# EAGLE schematic MainECU rev10 (EAGLE 9.6.2)

## Sheet 1 of 4: Inputs/Outputs and Power
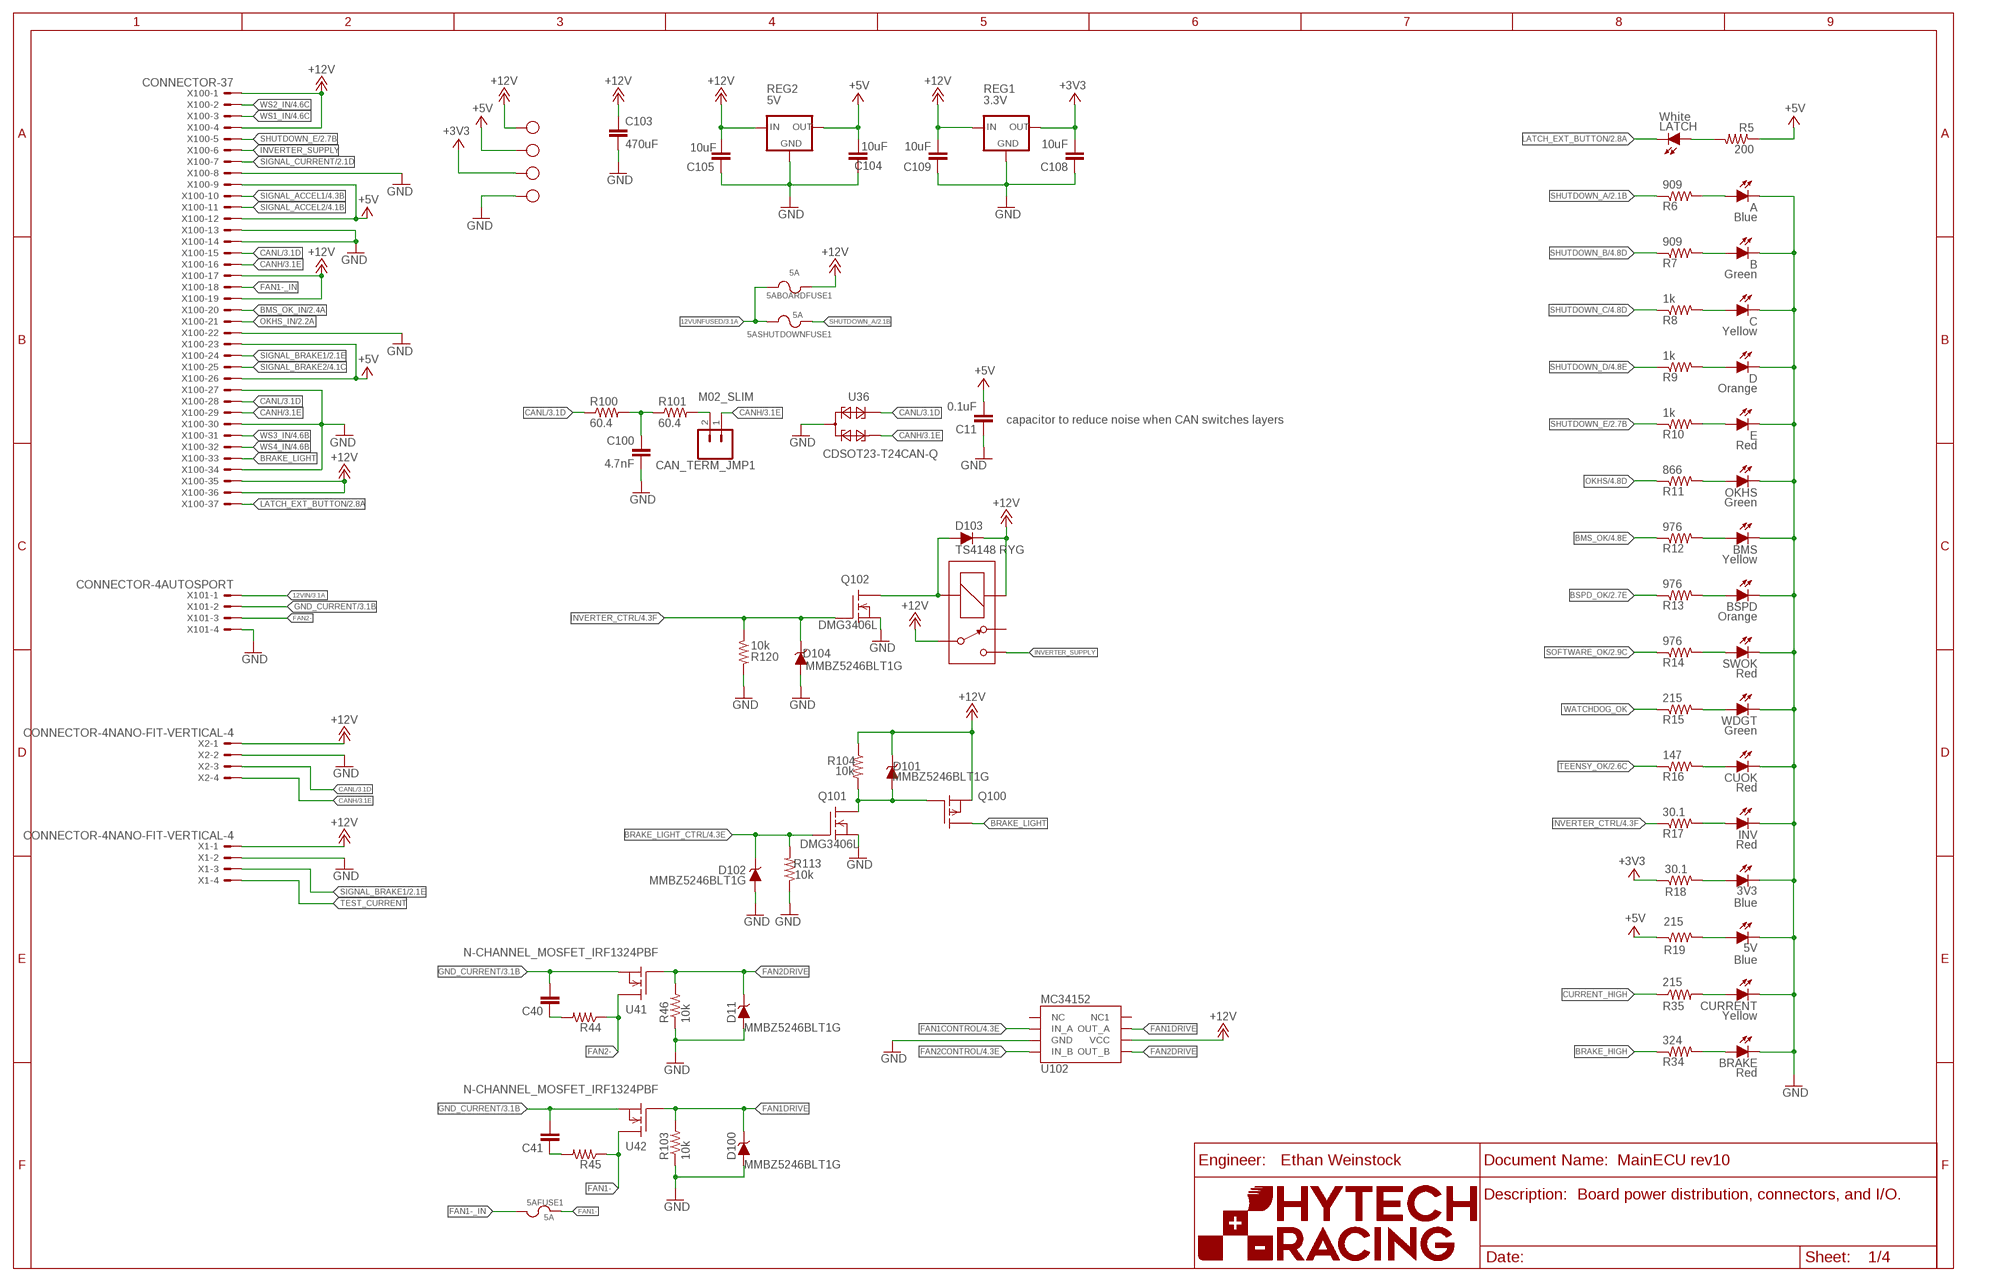
[diagram p0: schematic, sheet 1]
U201 (FRAME_B_L): ORIENTATION: LANDSCAPE; SIZE: B

### Parts
3V3  Blue  LED-0805  [LED-805]
3V3_TEST  TEST_POINTMICRO_MINIATURE  [MICRO_MINIATURE]
5ABOARDFUSE1  5A  FUSE_MINIBLADE  [MINI-BLADE_FUSE_HOLDER]
5AFUSE1  5A  FUSE_MINIBLADE  [MINI-BLADE_FUSE_HOLDER]
5ASHUTDOWNFUSE1  5A  FUSE_MINIBLADE  [MINI-BLADE_FUSE_HOLDER]
5V  Blue  LED-0805  [LED-805]
12V_TEST  12V_TEST  TEST_POINTMICRO_MINIATURE  [MICRO_MINIATURE]
A  Blue  LED-0805  [LED-805]
B  Green  LED-0805  [LED-805]
BMS  Yellow  LED-0805  [LED-805]
BRAKE  Red  LED-0805  [LED-805]
BSPD  Orange  LED-0805  [LED-805]
C  Yellow  LED-0805  [LED-805]
C11  0.1uF  CAP0603-CAP  [0603-CAP]
C40  CAP0603-CAP  [0603-CAP]
C41  CAP0603-CAP  [0603-CAP]
C100  4.7nF  CAP0603-CAP  [0603-CAP]
C103  470uF  CAPPTH3  [CAP-PTH-LARGE]
C104  10uF  CAP0603-CAP  [0603-CAP]
C105  10uF  CAP0603-CAP  [0603-CAP]
C108  10uF  CAP0603-CAP  [0603-CAP]
C109  10uF  CAP0603-CAP  [0603-CAP]
CAN_TERM_JMP1  M02_SLIM  [1X02_SLIM]
CUOK  Red  LED-0805  [LED-805]
CURRENT  Yellow  LED-0805  [LED-805]
D  Orange  LED-0805  [LED-805]
D11  MMBZ5246BLT1G  DIODE_ZENER  [SOT23]
D100  MMBZ5246BLT1G  DIODE_ZENER  [SOT23]
D101  MMBZ5246BLT1G  DIODE_ZENER  [SOT23]
D102  MMBZ5246BLT1G  DIODE_ZENER  [SOT23]
D103  TS4148 RYG  DIODE0805  [0805_D]
D104  MMBZ5246BLT1G  DIODE_ZENER  [SOT23]
E  Red  LED-0805  [LED-805]
INV  Red  LED-0805  [LED-805]
INVERTER_PWR_RELAY1  G5LE  [ZF112]
LATCH  White  LED-0805  [LED-805]
OKHS  Green  LED-0805  [LED-805]
Q100  P-CHANNEL_MOSFET_DMP3099L-7  [SOT23]
Q101  DMG3406L  DMG3406LSOT  [SOT23]
Q102  DMG3406L  DMG3406LSOT  [SOT23]
R5  200  RESISTOR0603  [0603-RES]
R6  909  RESISTOR0603  [0603-RES]
R7  909  RESISTOR0603  [0603-RES]
R8  1k  RESISTOR0603  [0603-RES]
R9  1k  RESISTOR0603  [0603-RES]
R10  1k  RESISTOR0603  [0603-RES]
R11  866  RESISTOR0603  [0603-RES]
R12  976  RESISTOR0603  [0603-RES]
R13  976  RESISTOR0603  [0603-RES]
R14  976  RESISTOR0603  [0603-RES]
R15  215  RESISTOR0603  [0603-RES]
R16  147  RESISTOR0603  [0603-RES]
R17  30.1  RESISTOR0603  [0603-RES]
R18  30.1  RESISTOR0603  [0603-RES]
R19  215  RESISTOR0603  [0603-RES]
R34  324  RESISTOR0603  [0603-RES]
R35  215  RESISTOR0603  [0603-RES]
R44  RESISTOR0603  [0603-RES]
R45  RESISTOR0603  [0603-RES]
R46  10k  RESISTOR0603  [0603-RES]
R100  60.4  RESISTOR0603  [0603-RES]
R101  60.4  RESISTOR0603  [0603-RES]
R103  10k  RESISTOR0603  [0603-RES]
R104  10k  RESISTOR0603  [0603-RES]
R113  10k  RESISTOR0603  [0603-RES]
R120  10k  RESISTOR0603  [0603-RES]
REG1  3.3V  OKI-78SR-3.3  [OKI-78SR]
REG2  5V  OKI-78SR-5  [OKI-78SR]
SWOK  Red  LED-0805  [LED-805]
U36  CDSOT23-T24CAN-Q  [SOT23]
U40  TEST_POINTMICRO_MINIATURE  [MICRO_MINIATURE]
U41  N-CHANNEL_MOSFET_IRF1324PBF  N-CHANNEL_MOSFET_HOR_HOLE  [TO-220-H-HOLE]
U42  N-CHANNEL_MOSFET_IRF1324PBF  N-CHANNEL_MOSFET_HOR_HOLE  [TO-220-H-HOLE]
U43  TEST_POINTMICRO_MINIATURE  [MICRO_MINIATURE]
U102  MC34152  [SOIC-08]
WDGT  Green  LED-0805  [LED-805]
X1  CONNECTOR-4NANO-FIT-VERTICAL-4  [NANO-FIT_VERTICAL-4]
X2  CONNECTOR-4NANO-FIT-VERTICAL-4  [NANO-FIT_VERTICAL-4]
X100  CONNECTOR-37  [AUTOSPORT_14-35]
X101  CONNECTOR-4AUTOSPORT  [AUTOSPORT_12-04]

### Nets
12VIN: X101.P$1 ; also sheet 3
12VUNFUSED: 5ABOARDFUSE1.L1 5ABOARDFUSE1.L2 5ASHUTDOWNFUSE1.L1 5ASHUTDOWNFUSE1.L2 ; also sheet 3
+3V3: 3V3_TEST.P$1 C108.2 R18.1 REG1.3(OUT) ; also sheet 2,3,4
+5V: C11.2 C104.2 R5.1 R19.1 REG2.3(OUT) U43.P$1 X100.P$9 X100.P$12 X100.P$23 X100.P$26 ; also sheet 2,3,4
+12V: 5ABOARDFUSE1.R1 5ABOARDFUSE1.R2 12V_TEST.P$1 C103.1 C105.2 C109.2 D101.3(C) D103.C INVERTER_PWR_RELAY1.1(COIL+) INVERTER_PWR_RELAY1.P Q100.2(S) R104.1 REG1.1(IN) REG2.1(IN) U102.6(VCC) X1.P$1 X2.P$1 X100.P$1 X100.P$4 X100.P$17 X100.P$19 X100.P$35 X100.P$36 ; also sheet 2,3
BMS_OK: R12.1 ; also sheet 2,4
BMS_OK_IN: X100.P$20 ; also sheet 2
BRAKE_HIGH: R34.1 ; also sheet 2
BRAKE_LIGHT: Q100.3(D) X100.P$33
BRAKE_LIGHT_CTRL: D102.3(C) Q101.1(G) R113.2 ; also sheet 4
BSPD_OK: R13.1 ; also sheet 2,4
CANH: CAN_TERM_JMP1.1 U36.2 X2.P$4 X100.P$16 X100.P$29 ; also sheet 3,4
CANL: R100.1 U36.1 X2.P$3 X100.P$15 X100.P$28 ; also sheet 3,4
CURRENT_HIGH: R35.1 ; also sheet 2
FAN1-: 5AFUSE1.R1 5AFUSE1.R2 R45.1 U42.2(D)
FAN1-_IN: 5AFUSE1.L1 5AFUSE1.L2 X100.P$18
FAN1CONTROL: U102.2(IN_A) ; also sheet 4
FAN1DRIVE: D100.3(C) R103.2 U42.1(G) U102.7(OUT_A)
FAN2-: R44.1 U41.2(D) X101.P$3
FAN2CONTROL: U102.4(IN_B) ; also sheet 4
FAN2DRIVE: D11.3(C) R46.2 U41.1(G) U102.5(OUT_B)
GND: 3V3.C 5V.C A.C B.C BMS.C BRAKE.C BSPD.C C11.1 C100.2 C103.2 C104.1 C105.1 C108.1 C109.1 C.C CUOK.C CURRENT.C D11.1(A) D100.1(A) D102.1(A) D104.1(A) D.C E.C INV.C OKHS.C Q101.2(S) Q102.2(S) R46.1 R103.1 R113.1 R120.2 REG1.2(GND) REG2.2(GND) SWOK.C U36.3 U40.P$1 U102.3(GND) WDGT.C X1.P$2 X2.P$2 X100.P$8 X100.P$13 X100.P$14 X100.P$22 X100.P$27 X100.P$30 X100.P$34 X101.P$4 ; also sheet 2,3,4
GND_CURRENT: C40.2 C41.2 U41.3(S) U42.3(S) X101.P$2 ; also sheet 3
INVERTER_CTRL: D104.3(C) Q102.1(G) R17.1 R120.1 ; also sheet 4
INVERTER_SUPPLY: INVERTER_PWR_RELAY1.S X100.P$6
LATCH_EXT_BUTTON: LATCH.C X100.P$37 ; also sheet 2
N$9: E.A R10.2
N$20: R14.2 SWOK.A
N$21: R15.2 WDGT.A
N$23: CUOK.A R16.2
N$34: A.A R6.2
N$36: 3V3.A R18.2
N$65: C40.1 R44.2
N$74: C41.1 R45.2
N$97: B.A R7.2
N$98: C.A R8.2
N$99: LATCH.A R5.2
N$100: OKHS.A R11.2
N$101: BMS.A R12.2
N$102: CURRENT.A R35.2
N$103: BRAKE.A R34.2
N$108: BSPD.A R13.2
N$113: 5V.A R19.2
N$114: D101.1(A) Q100.1(G) Q101.3(D) R104.2
N$115: D.A R9.2
N$116: INV.A R17.2
N$117: D103.A INVERTER_PWR_RELAY1.2(COIL-) Q102.3(D)
N$118: CAN_TERM_JMP1.2 R101.2
N$119: C100.1 R100.2 R101.1
OKHS: R11.1 ; also sheet 2,4
OKHS_IN: X100.P$21 ; also sheet 2
SHUTDOWN_A: 5ASHUTDOWNFUSE1.R1 5ASHUTDOWNFUSE1.R2 R6.1 ; also sheet 2
SHUTDOWN_B: R7.1 ; also sheet 2,4
SHUTDOWN_C: R8.1 ; also sheet 2,4
SHUTDOWN_D: R9.1 ; also sheet 2,4
SHUTDOWN_E: R10.1 X100.P$5 ; also sheet 2,4
SIGNAL_ACCEL1: X100.P$10 ; also sheet 4
SIGNAL_ACCEL2: X100.P$11 ; also sheet 4
SIGNAL_BRAKE1: X1.P$3 X100.P$24 ; also sheet 2,4
SIGNAL_BRAKE2: X100.P$25 ; also sheet 4
SIGNAL_CURRENT: X100.P$7 ; also sheet 2
SOFTWARE_OK: R14.1 ; also sheet 2,4
TEENSY_OK: R16.1 ; also sheet 2,4
TEST_CURRENT: X1.P$4 ; also sheet 2
WATCHDOG_OK: R15.1 ; also sheet 2
WS1_IN: X100.P$3 ; also sheet 4
WS2_IN: X100.P$2 ; also sheet 4
WS3_IN: X100.P$31 ; also sheet 4
WS4_IN: X100.P$32 ; also sheet 4
Unconnected: INVERTER_PWR_RELAY1.O U102.1(NC) U102.8(NC1)

### Notes on the sheet
- capacitor to reduce noise when CAN switches layers
- Ethan Weinstock
- Board power distribution, connectors, and I/O.

## Sheet 2 of 4: Shutdown Circuitry
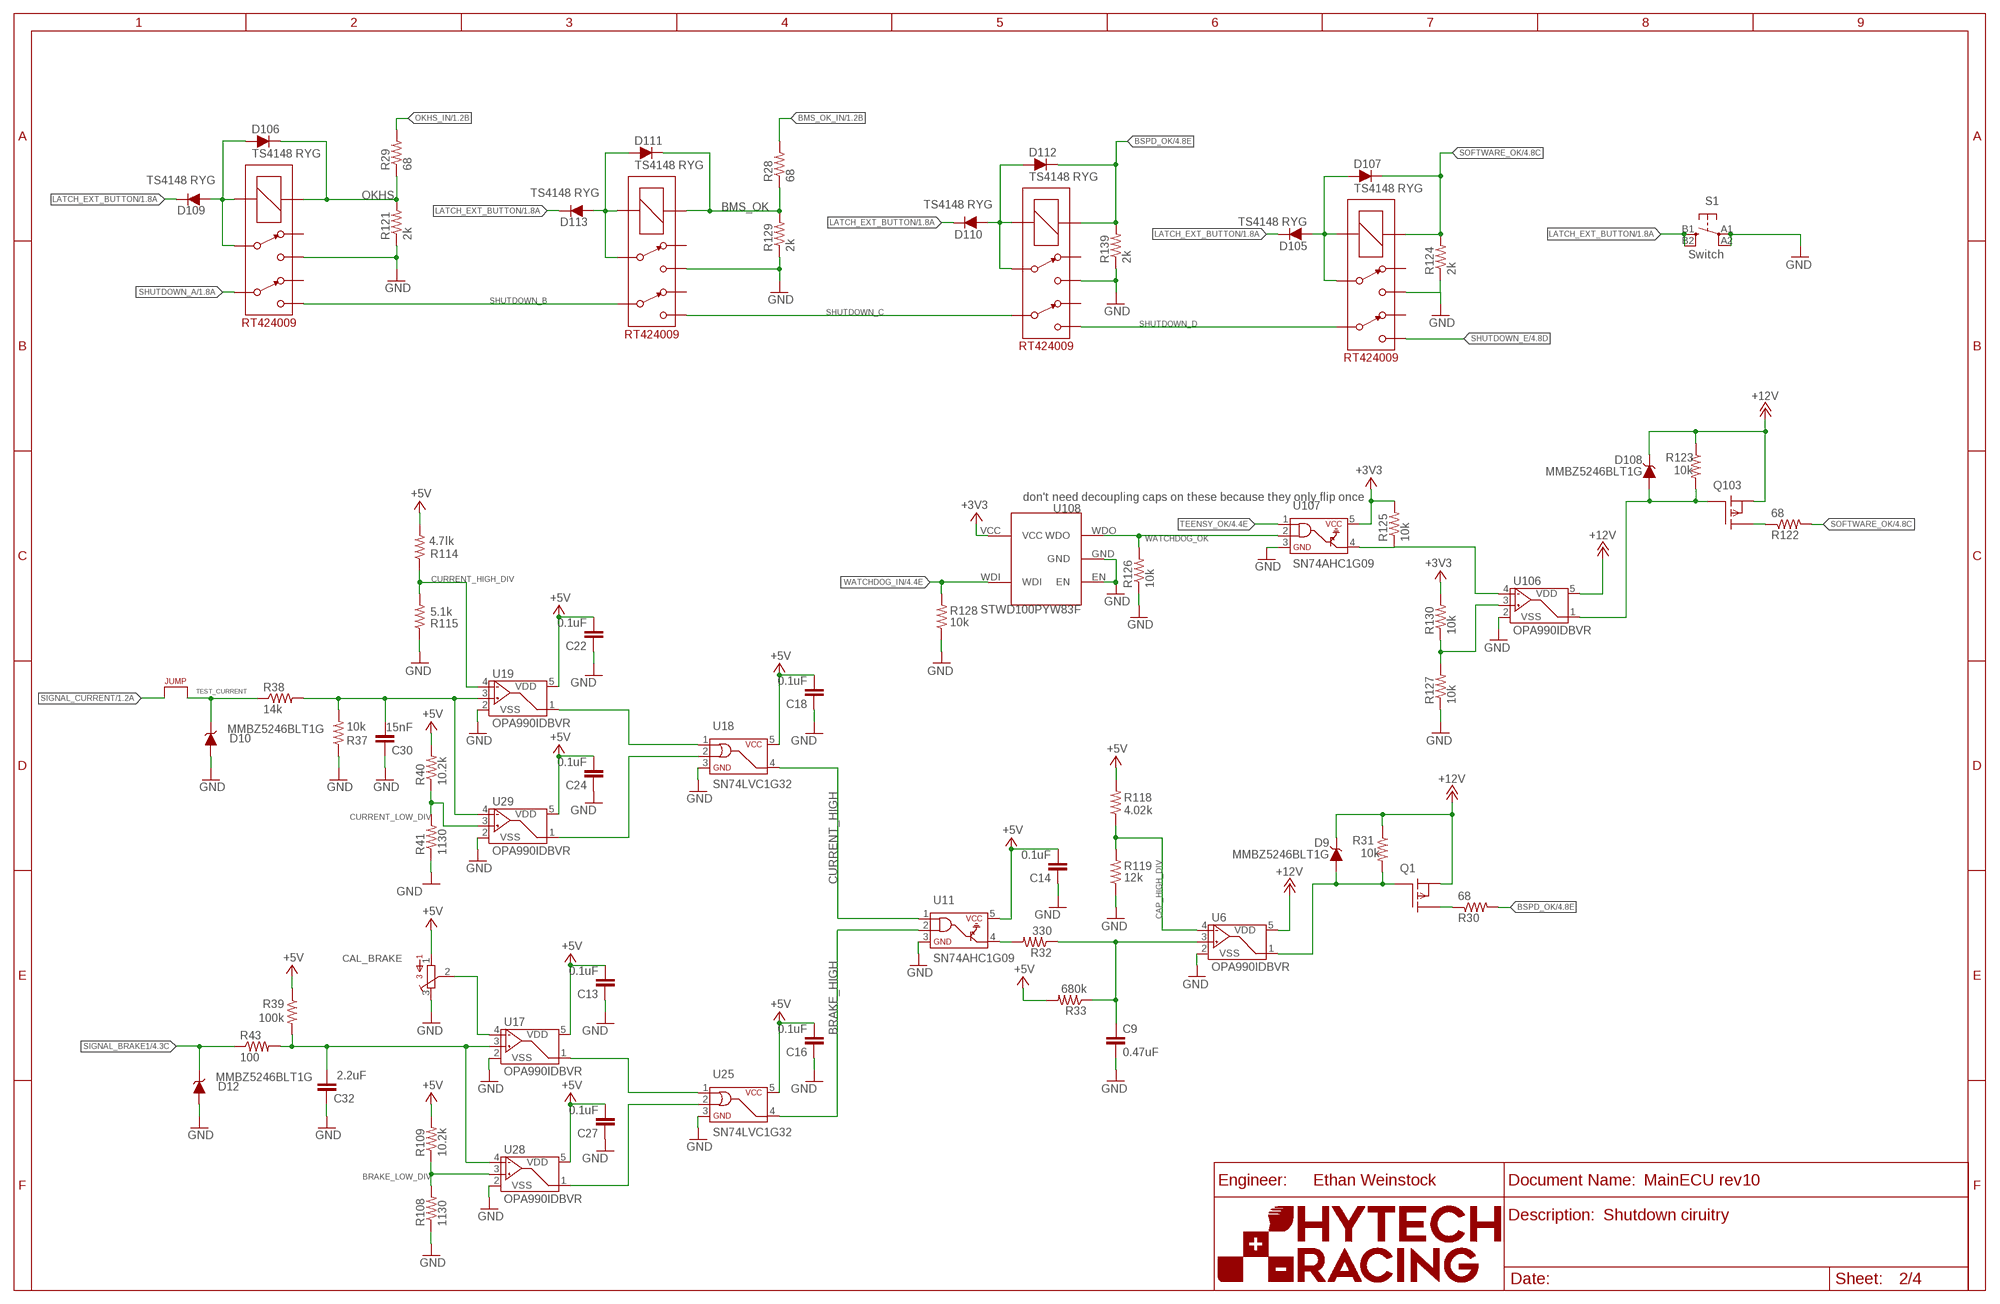
[diagram p1: schematic, sheet 2]
U202 (FRAME_B_L): ORIENTATION: LANDSCAPE; SIZE: B

### Parts
C9  0.47uF  CAP0603-CAP  [0603-CAP]
C13  0.1uF  CAP0603-CAP  [0603-CAP]
C14  0.1uF  CAP0603-CAP  [0603-CAP]
C16  0.1uF  CAP0603-CAP  [0603-CAP]
C18  0.1uF  CAP0603-CAP  [0603-CAP]
C22  0.1uF  CAP0603-CAP  [0603-CAP]
C24  0.1uF  CAP0603-CAP  [0603-CAP]
C27  0.1uF  CAP0603-CAP  [0603-CAP]
C30  15nF  CAP0603-CAP  [0603-CAP]
C32  2.2uF  CAP0603-CAP  [0603-CAP]
CAL_BRAKE  TRIMPOT_3296C  [TRIMPOT_3296]
D9  MMBZ5246BLT1G  DIODE_ZENER  [SOT23]
D10  MMBZ5246BLT1G  DIODE_ZENER  [SOT23]
D12  MMBZ5246BLT1G  DIODE_ZENER  [SOT23]
D105  TS4148 RYG  DIODE0805  [0805_D]
D106  TS4148 RYG  DIODE0805  [0805_D]
D107  TS4148 RYG  DIODE0805  [0805_D]
D108  MMBZ5246BLT1G  DIODE_ZENER  [SOT23]
D109  TS4148 RYG  DIODE0805  [0805_D]
D110  TS4148 RYG  DIODE0805  [0805_D]
D111  TS4148 RYG  DIODE0805  [0805_D]
D112  TS4148 RYG  DIODE0805  [0805_D]
D113  TS4148 RYG  DIODE0805  [0805_D]
IMD_SHUTDOWN_RLY1  RT424009  [RELAY_DPDT]
J1  JUMPER.1  [1X02]
Q1  P-CHANNEL_MOSFET_DMP3099L-7  [SOT23]
Q103  P-CHANNEL_MOSFET_DMP3099L-7  [SOT23]
R28  68  RESISTOR0603  [0603-RES]
R29  68  RESISTOR0603  [0603-RES]
R30  68  RESISTOR0603  [0603-RES]
R31  10k  RESISTOR0603  [0603-RES]
R32  330  RESISTOR0603  [0603-RES]
R33  680k  RESISTOR0603  [0603-RES]
R37  10k  RESISTOR0603  [0603-RES]
R38  14k  RESISTOR0603  [0603-RES]
R39  100k  RESISTOR0603  [0603-RES]
R40  10.2k  RESISTOR0603  [0603-RES]
R41  1130  RESISTOR0603  [0603-RES]
R43  100  RESISTOR0603  [0603-RES]
R108  1130  RESISTOR0603  [0603-RES]
R109  10.2k  RESISTOR0603  [0603-RES]
R114  4.7lk  RESISTOR0603  [0603-RES]
R115  5.1k  RESISTOR0603  [0603-RES]
R118  4.02k  RESISTOR0603  [0603-RES]
R119  12k  RESISTOR0603  [0603-RES]
R121  2k  RESISTOR0603  [0603-RES]
R122  68  RESISTOR0603  [0603-RES]
R123  10k  RESISTOR0603  [0603-RES]
R124  2k  RESISTOR0603  [0603-RES]
R125  10k  RESISTOR0603  [0603-RES]
R126  10k  RESISTOR0603  [0603-RES]
R127  10k  RESISTOR0603  [0603-RES]
R128  10k  RESISTOR0603  [0603-RES]
R129  2k  RESISTOR0603  [0603-RES]
R130  10k  RESISTOR0603  [0603-RES]
R139  2k  RESISTOR0603  [0603-RES]
S1  Switch  BTN_10-XXSMD  [TACTILE_SWITCH_SMD_6.2MM_TALL]
U2  RT424009  [RELAY_DPDT]
U3  RT424009  [RELAY_DPDT]
U4  RT424009  [RELAY_DPDT]
U6  OPA990IDBVR  [SOT-23-5]
U11  SN74AHC1G09  [SOT-23-5]
U17  OPA990IDBVR  [SOT-23-5]
U18  SN74LVC1G32  SN74LVC1G32"  [SOT-23-5]
U19  OPA990IDBVR  [SOT-23-5]
U25  SN74LVC1G32  SN74LVC1G32"  [SOT-23-5]
U28  OPA990IDBVR  [SOT-23-5]
U29  OPA990IDBVR  [SOT-23-5]
U106  OPA990IDBVR  [SOT-23-5]
U107  SN74AHC1G09  [SOT-23-5]
U108  STWD100PYW83F  [SOT323-5]

### Nets
+3V3: R125.2 R130.2 U107.5 U108.VCC ; also sheet 1,3,4
+5V: C13.2 C14.2 C16.2 C18.2 C22.2 C24.2 C27.2 CAL_BRAKE.1 R33.2 R39.1 R40.2 R109.2 R114.2 R118.2 U11.5 U17.5(VDD) U18.5(VCC) U19.5(VDD) U25.5(VCC) U28.5(VDD) U29.5(VDD) ; also sheet 1,3,4
+12V: D9.3(C) D108.3(C) Q1.2(S) Q103.2(S) R31.1 R123.1 U6.5(VDD) U106.5(VDD) ; also sheet 1,3
BMS_OK: D111.C R28.1 R129.2 U3.COIL+ ; also sheet 1,4
BMS_OK_IN: R28.2 ; also sheet 1
BMS_PWR_STEP1: D111.A D113.A U3.3 U3.COIL-
BRAKE_HIGH: U11.2 U25.4(Y) ; also sheet 1
BRAKE_LOW_DIV: R108.2 R109.1 U28.3(VIN+)
BSPD_OK: D112.C R30.2 R139.2 U2.COIL+ ; also sheet 1,4
CAP_HIGH_DIV: R118.1 R119.2 U6.4(VIN-)
CURRENT_HIGH: U11.1 U18.4(Y) ; also sheet 1
CURRENT_HIGH_DIV: R114.1 R115.2 U19.4(VIN-)
CURRENT_LOW_DIV: R40.1 R41.2 U29.3(VIN+)
GND: C9.2 C13.1 C14.1 C16.1 C18.1 C22.1 C24.1 C27.1 C30.1 C32.1 CAL_BRAKE.3 D10.1(A) D12.1(A) IMD_SHUTDOWN_RLY1.4 R37.1 R41.1 R108.1 R115.1 R119.1 R121.1 R124.1 R126.1 R127.1 R128.1 R129.1 R139.1 S1.A1(P) S1.A2(P1) U2.4 U3.4 U4.4 U6.2(VSS) U11.3 U17.2(VSS) U18.3(GND) U19.2(VSS) U25.3(GND) U28.2(VSS) U29.2(VSS) U106.2(VSS) U107.3 U108.EN U108.GND ; also sheet 1,3,4
IMD_PWR_STEP1: D106.A D109.A IMD_SHUTDOWN_RLY1.3 IMD_SHUTDOWN_RLY1.COIL-
LATCH_EXT_BUTTON: D105.C D109.C D110.C D113.C S1.B1(S) S1.B2(S1) ; also sheet 1
N$1: Q1.3(D) R30.1
N$5: C32.2 R39.2 R43.2 U17.3(VIN+) U28.4(VIN-)
N$6: U17.1(VOUT) U25.1(A)
N$7: D105.A D107.A U4.3 U4.COIL-
N$8: U25.2(B) U28.1(VOUT)
N$10: D108.1(A) Q103.1(G) R123.2 U106.1(VOUT)
N$11: Q103.3(D) R122.1
N$15: CAL_BRAKE.2 U17.4(VIN-)
N$18: U18.1(A) U19.1(VOUT)
N$19: U18.2(B) U29.1(VOUT)
N$26: R125.1 U106.4(VIN-) U107.4
N$27: R127.2 R130.1 U106.3(VIN+)
N$105: D110.A D112.A U2.3 U2.COIL-
N$106: C30.2 R37.2 R38.2 U19.3(VIN+) U29.4(VIN-)
N$107: R32.2 U11.4
N$109: C9.1 R32.1 R33.1 U6.3(VIN+)
N$112: D9.1(A) Q1.1(G) R31.2 U6.1(VOUT)
OKHS: D106.C IMD_SHUTDOWN_RLY1.COIL+ R29.1 R121.2 ; also sheet 1,4
OKHS_IN: R29.2 ; also sheet 1
SHUTDOWN_A: IMD_SHUTDOWN_RLY1.6 ; also sheet 1
SHUTDOWN_B: IMD_SHUTDOWN_RLY1.5 U3.6 ; also sheet 1,4
SHUTDOWN_C: U2.6 U3.5 ; also sheet 1,4
SHUTDOWN_D: U2.5 U4.6 ; also sheet 1,4
SHUTDOWN_E: U4.5 ; also sheet 1,4
SIGNAL_BRAKE1: D12.3(C) R43.1 ; also sheet 1,4
SIGNAL_CURRENT: J1.1 ; also sheet 1
SOFTWARE_OK: D107.C R122.2 R124.2 U4.COIL+ ; also sheet 1,4
TEENSY_OK: U107.1 ; also sheet 1,4
TEST_CURRENT: D10.3(C) J1.2 R38.1 ; also sheet 1
WATCHDOG_IN: R128.2 U108.WDI ; also sheet 4
WATCHDOG_OK: R126.2 U107.2 U108.WDO ; also sheet 1
Unconnected: IMD_SHUTDOWN_RLY1.2 IMD_SHUTDOWN_RLY1.7 U2.2 U2.7 U3.2 U3.7 U4.2 U4.7

### Notes on the sheet
- don't need decoupling caps on these because they only flip once
- Ethan Weinstock
- Shutdown ciruitry

## Sheet 3 of 4: Telemetry
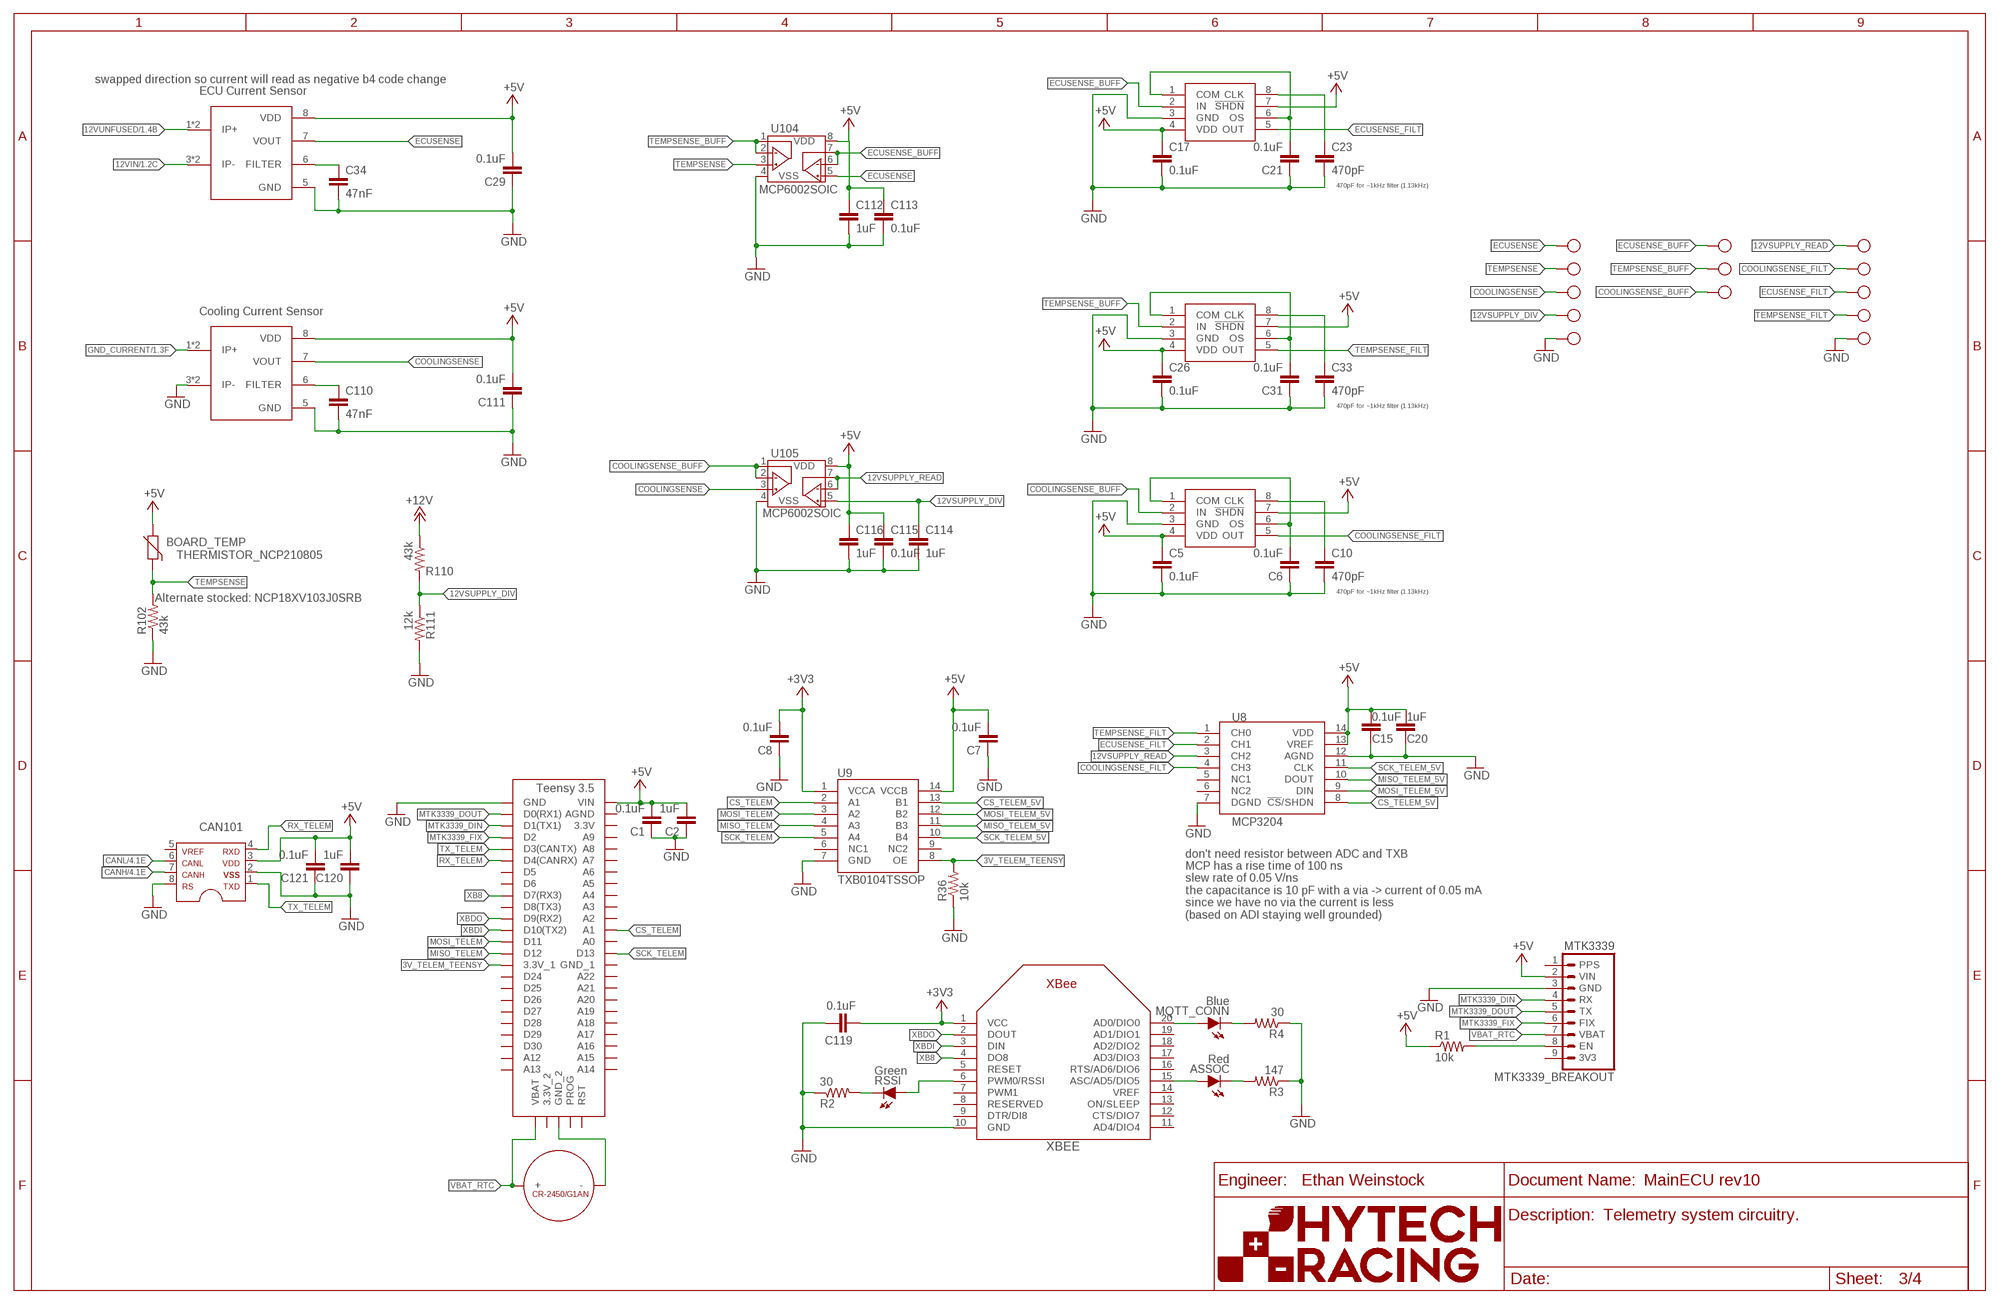
[diagram p2: schematic, sheet 3]
U203 (FRAME_B_L): ORIENTATION: LANDSCAPE; SIZE: B

### Parts
ASSOC  Red  LED-0805  [LED-805]
BOARD_TEMP  THERMISTOR_NCP210805  [0805]
C1  0.1uF  CAP0603-CAP  [0603-CAP]
C2  1uF  CAP0603-CAP  [0603-CAP]
C5  0.1uF  CAP0603-CAP  [0603-CAP]
C6  0.1uF  CAP0603-CAP  [0603-CAP]
C7  0.1uF  CAP0603-CAP  [0603-CAP]
C8  0.1uF  CAP0603-CAP  [0603-CAP]
C10  470pF  CAP0603-CAP  [0603-CAP]
C15  0.1uF  CAP0603-CAP  [0603-CAP]
C17  0.1uF  CAP0603-CAP  [0603-CAP]
C20  1uF  CAP0603-CAP  [0603-CAP]
C21  0.1uF  CAP0603-CAP  [0603-CAP]
C23  470pF  CAP0603-CAP  [0603-CAP]
C26  0.1uF  CAP0603-CAP  [0603-CAP]
C29  0.1uF  CAP0603-CAP  [0603-CAP]
C31  0.1uF  CAP0603-CAP  [0603-CAP]
C33  470pF  CAP0603-CAP  [0603-CAP]
C34  47nF  CAP0603-CAP  [0603-CAP]
C110  47nF  CAP0603-CAP  [0603-CAP]
C111  0.1uF  CAP0603-CAP  [0603-CAP]
C112  1uF  CAP0603-CAP  [0603-CAP]
C113  0.1uF  CAP0603-CAP  [0603-CAP]
C114  1uF  CAP0603-CAP  [0603-CAP]
C115  0.1uF  CAP0603-CAP  [0603-CAP]
C116  1uF  CAP0603-CAP  [0603-CAP]
C119  0.1uF  CAP0603-CAP  [0603-CAP]
C120  1uF  CAP0603-CAP  [0603-CAP]
C121  0.1uF  CAP0603-CAP  [0603-CAP]
CAN101  MCP2551  [SOIC-08]
MQTT_CONN  Blue  LED-0805  [LED-805]
MTK3339_BREAKOUT  MTK3339  [1X09]
R1  10k  RESISTOR0603  [0603-RES]
R2  30  RESISTOR0603  [0603-RES]
R3  147  RESISTOR0603  [0603-RES]
R4  30  RESISTOR0603  [0603-RES]
R36  10k  RESISTOR0603  [0603-RES]
R102  43k  RESISTOR0603  [0603-RES]
R110  43k  RESISTOR0603  [0603-RES]
R111  12k  RESISTOR0603  [0603-RES]
RSSI  Green  LED-0805  [LED-805]
U1  TEENSY_3.5_EXT  [TEENSY_3.5_EXT]
U7  MAX7480  [SOIC-08]
U8  MCP3204  [SO14]
U9  TXB0104TSSOP  [TSSOP-14]
U12  TEST_POINTMICRO_MINIATURE  [MICRO_MINIATURE]
U13  TEST_POINTMICRO_MINIATURE  [MICRO_MINIATURE]
U14  TEST_POINTMICRO_MINIATURE  [MICRO_MINIATURE]
U15  TEST_POINTMICRO_MINIATURE  [MICRO_MINIATURE]
U16  TEST_POINTMICRO_MINIATURE  [MICRO_MINIATURE]
U20  TEST_POINTMICRO_MINIATURE  [MICRO_MINIATURE]
U21  TEST_POINTMICRO_MINIATURE  [MICRO_MINIATURE]
U22  TEST_POINTMICRO_MINIATURE  [MICRO_MINIATURE]
U24  MAX7480  [SOIC-08]
U26  TEST_POINTMICRO_MINIATURE  [MICRO_MINIATURE]
U27  TEST_POINTMICRO_MINIATURE  [MICRO_MINIATURE]
U30  TEST_POINTMICRO_MINIATURE  [MICRO_MINIATURE]
U31  TEST_POINTMICRO_MINIATURE  [MICRO_MINIATURE]
U32  TEST_POINTMICRO_MINIATURE  [MICRO_MINIATURE]
U33  MAX7480  [SOIC-08]
U35  ACHS-7121  [SOP8]
U103  ACHS-7121  [SOP8]
U104  MCP6002SOIC  [SOIC-08]
U105  MCP6002SOIC  [SOIC-08]
U109  CR-2450/G1AN  [CR-2450/G1AN]
XBEE  XBEE  [XBEE]

### Nets
3V_TELEM_TEENSY: R36.2 U1.3.3V_1 U9.8(OE)
12VIN: U35.3(IP-) U35.4(IP-) ; also sheet 1
12VSUPPLY_DIV: C114.1 R110.2 R111.1 U16.P$1 U105.5(VINB+)
12VSUPPLY_READ: U8.3(CH2) U15.P$1 U105.6(VINB-) U105.7(VOUTB)
12VUNFUSED: U35.1(IP+) U35.2(IP+) ; also sheet 1
+3V3: C8.2 C119.1 U9.1(VCCA) XBEE.1(VCC) ; also sheet 1,2,4
+5V: BOARD_TEMP.1 C1.2 C2.2 C5.1 C7.2 C15.2 C17.1 C20.2 C26.1 C29.2 C111.2 C112.1 C113.1 C115.1 C116.1 C120.2 C121.2 CAN101.3 MTK3339_BREAKOUT.2(VIN) R1.1 U1.VIN U7.4(VDD) U7.7(!SHDN) U8.13(VREF) U8.14(VDD) U9.14(VCCB) U24.4(VDD) U24.7(!SHDN) U33.4(VDD) U33.7(!SHDN) U35.8(VDD) U103.8(VDD) U104.8(VDD) U105.8(VDD) ; also sheet 1,2,4
+12V: R110.1 ; also sheet 1,2
CANH: CAN101.7 ; also sheet 1,4
CANL: CAN101.6 ; also sheet 1,4
COOLINGSENSE: U21.P$1 U103.7(VOUT) U105.3(VINA+)
COOLINGSENSE_BUFF: U7.2(IN) U12.P$1 U105.1(VOUTA) U105.2(VINA-)
COOLINGSENSE_FILT: U7.5(OUT) U8.4(CH3) U20.P$1
CS_TELEM: U1.A1 U9.2(A1)
CS_TELEM_5V: U8.8(!CS!/SHDN) U9.13(B1)
ECUSENSE: U27.P$1 U35.7(VOUT) U104.5(VINB+)
ECUSENSE_BUFF: U13.P$1 U24.2(IN) U104.6(VINB-) U104.7(VOUTB)
ECUSENSE_FILT: U8.2(CH1) U24.5(OUT) U26.P$1
GND: C1.1 C2.1 C5.2 C6.1 C7.1 C8.1 C10.2 C15.1 C17.2 C20.1 C21.1 C23.2 C26.2 C29.1 C31.1 C33.2 C34.2 C110.2 C111.1 C112.2 C113.2 C114.2 C115.2 C116.2 C119.2 C120.1 C121.1 CAN101.2 CAN101.8 MTK3339_BREAKOUT.3(GND) R2.1 R3.1 R4.1 R36.1 R102.1 R111.2 U1.GND U7.3(GND) U8.7(DGND) U8.12(AGND) U9.7(GND) U22.P$1 U24.3(GND) U32.P$1 U33.3(GND) U35.5(GND) U103.3(IP-) U103.4(IP-) U103.5(GND) U104.4(VSS) U105.4(VSS) XBEE.10(GND) ; also sheet 1,2,4
GND_CURRENT: U103.1(IP+) U103.2(IP+) ; also sheet 1
MISO_TELEM: U1.D12 U9.4(A3)
MISO_TELEM_5V: U8.10(DOUT) U9.11(B3)
MOSI_TELEM: U1.D11 U9.3(A2)
MOSI_TELEM_5V: U8.9(DIN) U9.12(B2)
MTK3339_DIN: MTK3339_BREAKOUT.4(RX) U1.D1(TX1)
MTK3339_DOUT: MTK3339_BREAKOUT.5(TX) U1.D0(RX1)
MTK3339_FIX: MTK3339_BREAKOUT.6(FIX) U1.D2
N$16: C10.1 U7.8(CLK)
N$17: C6.2 U7.1(COM) U7.6(OS)
N$122: C110.1 U103.6(FILTER)
N$123: C34.1 U35.6(FILTER)
N$126: R2.2 RSSI.C
N$127: RSSI.A XBEE.6(PWM0/RSSI)
N$128: ASSOC.A XBEE.15(ASC/AD5/DIO5)
N$129: ASSOC.C R3.2
N$130: MQTT_CONN.C R4.2
N$131: MQTT_CONN.A XBEE.20(AD0/DIO0)
N$132: U1.GND_2 U109.-
N$134: C33.1 U33.8(CLK)
N$136: C23.1 U24.8(CLK)
N$139: MTK3339_BREAKOUT.8(EN) R1.2
N$142: C21.2 U24.1(COM) U24.6(OS)
N$143: C31.2 U33.1(COM) U33.6(OS)
RX_TELEM: CAN101.4 U1.D4(CANRX)
SCK_TELEM: U1.D13 U9.5(A4)
SCK_TELEM_5V: U8.11(CLK) U9.10(B4)
TEMPSENSE: BOARD_TEMP.2 R102.2 U31.P$1 U104.3(VINA+)
TEMPSENSE_BUFF: U14.P$1 U33.2(IN) U104.1(VOUTA) U104.2(VINA-)
TEMPSENSE_FILT: U8.1(CH0) U30.P$1 U33.5(OUT)
TX_TELEM: CAN101.1 U1.D3(CANTX)
VBAT_RTC: MTK3339_BREAKOUT.7(VBAT) U1.VBAT U109.+_0(+) U109.+_1(+)
XB8: U1.D7(RX3) XBEE.4(DO8)
XBDI: U1.D10(TX2) XBEE.3(DIN)
XBDO: U1.D9(RX2) XBEE.2(DOUT)
Unconnected: CAN101.5 MTK3339_BREAKOUT.1(PPS) MTK3339_BREAKOUT.9(3V3) U1.3.3V U1.3.3V_2 U1.A0 U1.A2 U1.A3 U1.A4 U1.A5 U1.A6 U1.A7 U1.A8 U1.A9 U1.A12 U1.A13 U1.A14 U1.A15 U1.A16 U1.A17 U1.A18 U1.A19 U1.A20 U1.A21 U1.A22 U1.AGND U1.D5 U1.D6 U1.D8(TX3) U1.D24 U1.D25 U1.D26 U1.D27 U1.D28 U1.D29 U1.D30 U1.GND_1 U1.PROG U1.RST U8.5(NC1) U8.6(NC2) U9.6(NC1) U9.9(NC2) XBEE.5(RESET) XBEE.7(PWM1) XBEE.8(RESERVED) XBEE.9(DTR/DI8) XBEE.11(AD4/DIO4) XBEE.12(CTS/DIO7) XBEE.13(ON/SLEEP) XBEE.14(VREF) XBEE.16(RTS/AD6/DIO6) XBEE.17(AD3/DIO3) XBEE.18(AD2/DIO2) XBEE.19(AD1/DIO1)

### Notes on the sheet
- swapped direction so current will read as negative b4 code change
- ECU Current Sensor
- 470pF for ~1kHz filter (1.13kHz)
- Cooling Current Sensor
- 470pF for ~1kHz filter (1.13kHz)
- Alternate stocked: NCP18XV103J0SRB | 470pF for ~1kHz filter (1.13kHz)
- don't need resistor between ADC and TXB
  MCP has a rise time of 100 ns
  slew rate of 0.05 V/ns
  the capacitance is 10 pF with a via -> current of 0.05 mA
  since we have no via the current is less
  (based on ADI staying well grounded)
- Ethan Weinstock
- Telemetry system circuitry.

## Sheet 4 of 4: Analog Circuitry/Main Teensy
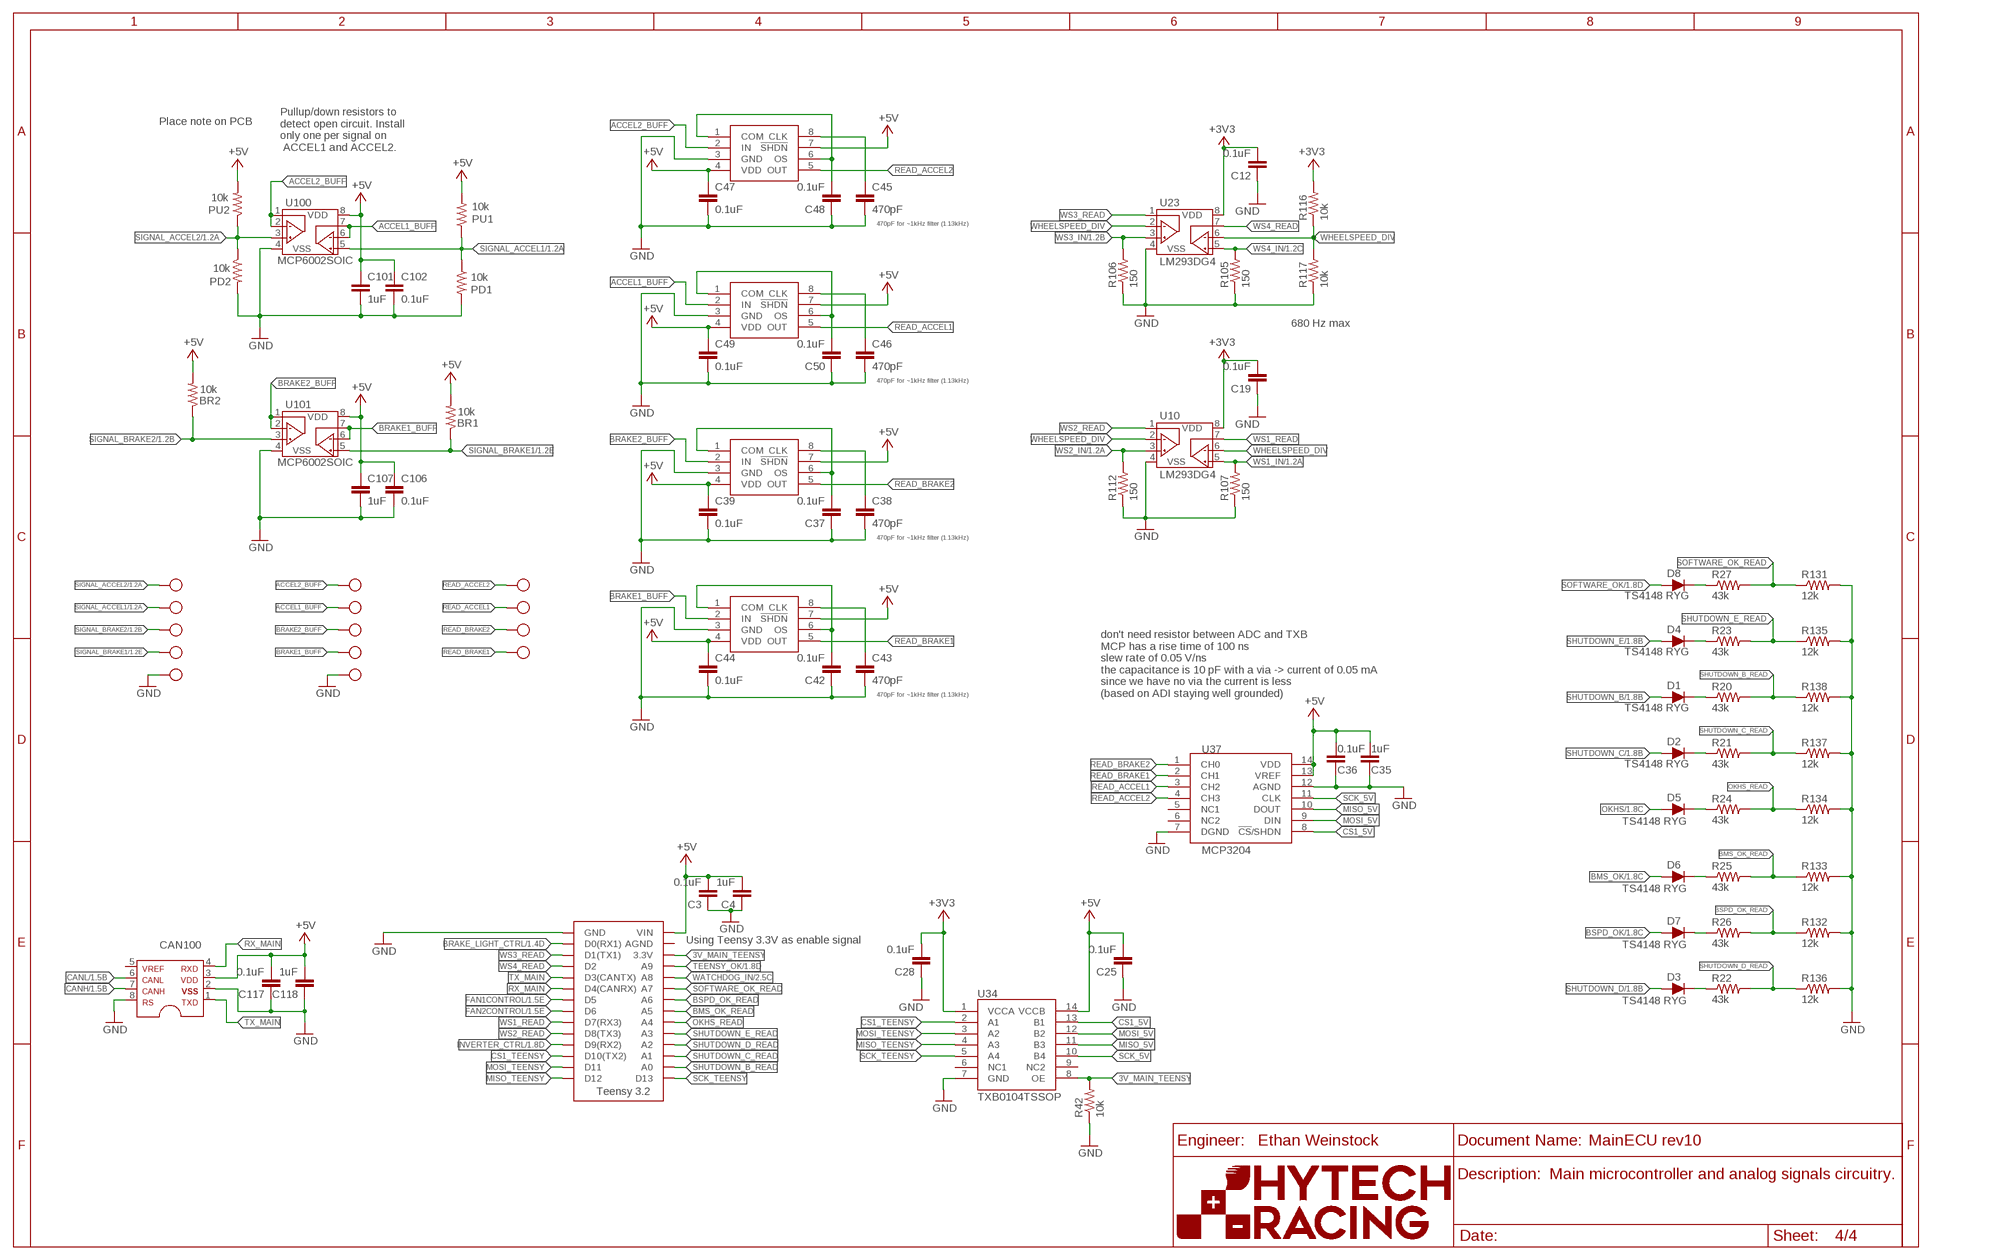
[diagram p3: schematic, sheet 4]
U204 (FRAME_B_L): ORIENTATION: LANDSCAPE; SIZE: B

### Parts
ACCEL1_BUFF_TEST  12V_TEST  TEST_POINTMICRO_MINIATURE  [MICRO_MINIATURE]
ACCEL2_BUFF_TEST  TEST_POINTMICRO_MINIATURE  [MICRO_MINIATURE]
BR1  10k  RESISTOR0603  [0603-RES]
BR2  10k  RESISTOR0603  [0603-RES]
BRAKE1_BUFF_TEST  TEST_POINTMICRO_MINIATURE  [MICRO_MINIATURE]
BRAKE2_BUFF_TEST  TEST_POINTMICRO_MINIATURE  [MICRO_MINIATURE]
C3  0.1uF  CAP0603-CAP  [0603-CAP]
C4  1uF  CAP0603-CAP  [0603-CAP]
C12  0.1uF  CAP0603-CAP  [0603-CAP]
C19  0.1uF  CAP0603-CAP  [0603-CAP]
C25  0.1uF  CAP0603-CAP  [0603-CAP]
C28  0.1uF  CAP0603-CAP  [0603-CAP]
C35  1uF  CAP0603-CAP  [0603-CAP]
C36  0.1uF  CAP0603-CAP  [0603-CAP]
C37  0.1uF  CAP0603-CAP  [0603-CAP]
C38  470pF  CAP0603-CAP  [0603-CAP]
C39  0.1uF  CAP0603-CAP  [0603-CAP]
C42  0.1uF  CAP0603-CAP  [0603-CAP]
C43  470pF  CAP0603-CAP  [0603-CAP]
C44  0.1uF  CAP0603-CAP  [0603-CAP]
C45  470pF  CAP0603-CAP  [0603-CAP]
C46  470pF  CAP0603-CAP  [0603-CAP]
C47  0.1uF  CAP0603-CAP  [0603-CAP]
C48  0.1uF  CAP0603-CAP  [0603-CAP]
C49  0.1uF  CAP0603-CAP  [0603-CAP]
C50  0.1uF  CAP0603-CAP  [0603-CAP]
C101  1uF  CAP0603-CAP  [0603-CAP]
C102  0.1uF  CAP0603-CAP  [0603-CAP]
C106  0.1uF  CAP0603-CAP  [0603-CAP]
C107  1uF  CAP0603-CAP  [0603-CAP]
C117  0.1uF  CAP0603-CAP  [0603-CAP]
C118  1uF  CAP0603-CAP  [0603-CAP]
CAN100  MCP2551  [SOIC-08]
D1  TS4148 RYG  DIODE0805  [0805_D]
D2  TS4148 RYG  DIODE0805  [0805_D]
D3  TS4148 RYG  DIODE0805  [0805_D]
D4  TS4148 RYG  DIODE0805  [0805_D]
D5  TS4148 RYG  DIODE0805  [0805_D]
D6  TS4148 RYG  DIODE0805  [0805_D]
D7  TS4148 RYG  DIODE0805  [0805_D]
D8  TS4148 RYG  DIODE0805  [0805_D]
PD1  10k  RESISTOR0603  [0603-RES]
PD2  10k  RESISTOR0603  [0603-RES]
PU1  10k  RESISTOR0603  [0603-RES]
PU2  10k  RESISTOR0603  [0603-RES]
R20  43k  RESISTOR0603  [0603-RES]
R21  43k  RESISTOR0603  [0603-RES]
R22  43k  RESISTOR0603  [0603-RES]
R23  43k  RESISTOR0603  [0603-RES]
R24  43k  RESISTOR0603  [0603-RES]
R25  43k  RESISTOR0603  [0603-RES]
R26  43k  RESISTOR0603  [0603-RES]
R27  43k  RESISTOR0603  [0603-RES]
R42  10k  RESISTOR0603  [0603-RES]
R105  150  RESISTOR0603  [0603-RES]
R106  150  RESISTOR0603  [0603-RES]
R107  150  RESISTOR0603  [0603-RES]
R112  150  RESISTOR0603  [0603-RES]
R116  10k  RESISTOR0603  [0603-RES]
R117  10k  RESISTOR0603  [0603-RES]
R131  12k  RESISTOR0603  [0603-RES]
R132  12k  RESISTOR0603  [0603-RES]
R133  12k  RESISTOR0603  [0603-RES]
R134  12k  RESISTOR0603  [0603-RES]
R135  12k  RESISTOR0603  [0603-RES]
R136  12k  RESISTOR0603  [0603-RES]
R137  12k  RESISTOR0603  [0603-RES]
R138  12k  RESISTOR0603  [0603-RES]
READ_ACCEL1_TEST  12V_TEST  TEST_POINTMICRO_MINIATURE  [MICRO_MINIATURE]
READ_ACCEL2_TEST  TEST_POINTMICRO_MINIATURE  [MICRO_MINIATURE]
READ_BRAKE1_TEST  TEST_POINTMICRO_MINIATURE  [MICRO_MINIATURE]
READ_BRAKE2_TEST  TEST_POINTMICRO_MINIATURE  [MICRO_MINIATURE]
SIGNAL_ACCEL1_TEST  12V_TEST  TEST_POINTMICRO_MINIATURE  [MICRO_MINIATURE]
SIGNAL_ACCEL2_TEST  TEST_POINTMICRO_MINIATURE  [MICRO_MINIATURE]
SIGNAL_BRAKE1_TEST  TEST_POINTMICRO_MINIATURE  [MICRO_MINIATURE]
SIGNAL_BRAKE2_TEST  TEST_POINTMICRO_MINIATURE  [MICRO_MINIATURE]
SIGNAL_GND  TEST_POINTMICRO_MINIATURE  [MICRO_MINIATURE]
U5  TEENSY_3.2_SIMPLE  [TEENSY_3.2_SIMPLE]
U10  LM293DG4  [SOIC-08]
U23  LM293DG4  [SOIC-08]
U34  TXB0104TSSOP  [TSSOP-14]
U37  MCP3204  [SO14]
U38  MAX7480  [SOIC-08]
U39  MAX7480  [SOIC-08]
U44  MAX7480  [SOIC-08]
U45  MAX7480  [SOIC-08]
U46  TEST_POINTMICRO_MINIATURE  [MICRO_MINIATURE]
U100  MCP6002SOIC  [SOIC-08]
U101  MCP6002SOIC  [SOIC-08]

### Nets
3V_MAIN_TEENSY: R42.2 U5.3.3V U34.8(OE)
+3V3: C12.2 C19.2 C28.2 R116.2 U10.8(VDD) U23.8(VDD) U34.1(VCCA) ; also sheet 1,2,3
+5V: BR1.2 BR2.2 C3.2 C4.2 C25.2 C35.2 C36.2 C39.1 C44.1 C47.1 C49.1 C101.1 C102.1 C106.1 C107.1 C117.2 C118.2 CAN100.3 PU1.2 PU2.2 U5.VIN U34.14(VCCB) U37.13(VREF) U37.14(VDD) U38.4(VDD) U38.7(!SHDN) U39.4(VDD) U39.7(!SHDN) U44.4(VDD) U44.7(!SHDN) U45.4(VDD) U45.7(!SHDN) U100.8(VDD) U101.8(VDD) ; also sheet 1,2,3
ACCEL1_BUFF: ACCEL2_BUFF_TEST.P$1 U45.2(IN) U100.6(VINB-) U100.7(VOUTB)
ACCEL2_BUFF: ACCEL1_BUFF_TEST.P$1 U44.2(IN) U100.1(VOUTA) U100.2(VINA-)
BMS_OK: D6.A ; also sheet 1,2
BMS_OK_READ: R25.2 R133.1 U5.A5
BRAKE1_BUFF: BRAKE2_BUFF_TEST.P$1 U39.2(IN) U101.6(VINB-) U101.7(VOUTB)
BRAKE2_BUFF: BRAKE1_BUFF_TEST.P$1 U38.2(IN) U101.1(VOUTA) U101.2(VINA-)
BRAKE_LIGHT_CTRL: U5.D0(RX1) ; also sheet 1
BSPD_OK: D7.A ; also sheet 1,2
BSPD_OK_READ: R26.2 R132.1 U5.A6
CANH: CAN100.7 ; also sheet 1,3
CANL: CAN100.6 ; also sheet 1,3
CS1_5V: U34.13(B1) U37.8(!CS!/SHDN)
CS1_TEENSY: U5.D10(TX2) U34.2(A1)
FAN1CONTROL: U5.D5 ; also sheet 1
FAN2CONTROL: U5.D6 ; also sheet 1
GND: C3.1 C4.1 C12.1 C19.1 C25.1 C28.1 C35.1 C36.1 C37.1 C38.2 C39.2 C42.1 C43.2 C44.2 C45.2 C46.2 C47.2 C48.1 C49.2 C50.1 C101.2 C102.2 C106.2 C107.2 C117.1 C118.1 CAN100.2 CAN100.8 PD1.2 PD2.2 R42.1 R105.1 R106.1 R107.1 R112.1 R117.1 R131.2 R132.2 R133.2 R134.2 R135.2 R136.2 R137.2 R138.2 SIGNAL_GND.P$1 U5.GND U10.4(VSS) U23.4(VSS) U34.7(GND) U37.7(DGND) U37.12(AGND) U38.3(GND) U39.3(GND) U44.3(GND) U45.3(GND) U46.P$1 U100.4(VSS) U101.4(VSS) ; also sheet 1,2,3
INVERTER_CTRL: U5.D9(RX2) ; also sheet 1
MISO_5V: U34.11(B3) U37.10(DOUT)
MISO_TEENSY: U5.D12 U34.4(A3)
MOSI_5V: U34.12(B2) U37.9(DIN)
MOSI_TEENSY: U5.D11 U34.3(A2)
N$12: C43.1 U39.8(CLK)
N$14: C42.2 U39.1(COM) U39.6(OS)
N$24: D4.C R23.1
N$25: D8.C R27.1
N$135: D5.C R24.1
N$137: D6.C R25.1
N$138: D3.C R22.1
N$146: D1.C R20.1
N$147: D2.C R21.1
N$150: D7.C R26.1
N$153: C45.1 U44.8(CLK)
N$154: C46.1 U45.8(CLK)
N$156: C48.2 U44.1(COM) U44.6(OS)
N$157: C38.1 U38.8(CLK)
N$158: C37.2 U38.1(COM) U38.6(OS)
N$163: C50.2 U45.1(COM) U45.6(OS)
OKHS: D5.A ; also sheet 1,2
OKHS_READ: R24.2 R134.1 U5.A4
READ_ACCEL1: READ_ACCEL2_TEST.P$1 U37.3(CH2) U45.5(OUT)
READ_ACCEL2: READ_ACCEL1_TEST.P$1 U37.4(CH3) U44.5(OUT)
READ_BRAKE1: READ_BRAKE2_TEST.P$1 U37.2(CH1) U39.5(OUT)
READ_BRAKE2: READ_BRAKE1_TEST.P$1 U37.1(CH0) U38.5(OUT)
RX_MAIN: CAN100.4 U5.D4(CANRX)
SCK_5V: U34.10(B4) U37.11(CLK)
SCK_TEENSY: U5.D13 U34.5(A4)
SHUTDOWN_B: D1.A ; also sheet 1,2
SHUTDOWN_B_READ: R20.2 R138.1 U5.A0
SHUTDOWN_C: D2.A ; also sheet 1,2
SHUTDOWN_C_READ: R21.2 R137.1 U5.A1
SHUTDOWN_D: D3.A ; also sheet 1,2
SHUTDOWN_D_READ: R22.2 R136.1 U5.A2
SHUTDOWN_E: D4.A ; also sheet 1,2
SHUTDOWN_E_READ: R23.2 R135.1 U5.A3
SIGNAL_ACCEL1: PD1.1 PU1.1 SIGNAL_ACCEL2_TEST.P$1 U100.5(VINB+) ; also sheet 1
SIGNAL_ACCEL2: PD2.1 PU2.1 SIGNAL_ACCEL1_TEST.P$1 U100.3(VINA+) ; also sheet 1
SIGNAL_BRAKE1: BR1.1 SIGNAL_BRAKE2_TEST.P$1 U101.5(VINB+) ; also sheet 1,2
SIGNAL_BRAKE2: BR2.1 SIGNAL_BRAKE1_TEST.P$1 U101.3(VINA+) ; also sheet 1
SOFTWARE_OK: D8.A ; also sheet 1,2
SOFTWARE_OK_READ: R27.2 R131.1 U5.A7
TEENSY_OK: U5.A9 ; also sheet 1,2
TX_MAIN: CAN100.1 U5.D3(CANTX)
WATCHDOG_IN: U5.A8 ; also sheet 2
WHEELSPEED_DIV: R116.1 R117.2 U10.2(VINA-) U10.6(VINB-) U23.2(VINA-) U23.6(VINB-)
WS1_IN: R107.2 U10.5(VINB+) ; also sheet 1
WS1_READ: U5.D7(RX3) U10.7(VOUTB)
WS2_IN: R112.2 U10.3(VINA+) ; also sheet 1
WS2_READ: U5.D8(TX3) U10.1(VOUTA)
WS3_IN: R106.2 U23.3(VINA+) ; also sheet 1
WS3_READ: U5.D1(TX1) U23.1(VOUTA)
WS4_IN: R105.2 U23.5(VINB+) ; also sheet 1
WS4_READ: U5.D2 U23.7(VOUTB)
Unconnected: CAN100.5 U5.AGND U34.6(NC1) U34.9(NC2) U37.5(NC1) U37.6(NC2)

### Notes on the sheet
- Place note on PCB
- Pullup/down resistors to
  detect open circuit. Install
  only one per signal on
   ACCEL1 and ACCEL2.
- 470pF for ~1kHz filter (1.13kHz)
- 680 Hz max
- 470pF for ~1kHz filter (1.13kHz)
- 470pF for ~1kHz filter (1.13kHz)
- 470pF for ~1kHz filter (1.13kHz)
- don't need resistor between ADC and TXB
  MCP has a rise time of 100 ns
  slew rate of 0.05 V/ns
  the capacitance is 10 pF with a via -> current of 0.05 mA
  since we have no via the current is less
  (based on ADI staying well grounded)
- Using Teensy 3.3V as enable signal
- Ethan Weinstock
- Main microcontroller and analog signals circuitry.

## Library data of the parts
3V3 5V A ASSOC B BMS BRAKE BSPD C CUOK CURRENT D E INV LATCH MQTT_CONN OKHS RSSI SWOK WDGT = HyTechDevices:LED: Light Emitting Diode (LED) Source: Dangerous Prototypes Eagle Library <https://github.com/DangerousPrototypes/Eagle_Part_Library>
3V3_TEST 12V_TEST ACCEL1_BUFF_TEST ACCEL2_BUFF_TEST BRAKE1_BUFF_TEST BRAKE2_BUFF_TEST READ_ACCEL1_TEST READ_ACCEL2_TEST READ_BRAKE1_TEST READ_BRAKE2_TEST SIGNAL_ACCEL1_TEST SIGNAL_ACCEL2_TEST SIGNAL_BRAKE1_TEST SIGNAL_BRAKE2_TEST SIGNAL_GND U12-U16 U20-U22 U26 U27 U30-U32 U40 U43 U46 = HyTechDevices:TEST_POINT: Keystone Electronics Test Point 5005
5ABOARDFUSE1 5AFUSE1 5ASHUTDOWNFUSE1 = HyTechDevices:FUSE: Fuse/Fuseclips Keystone Electronics 3568 Fuse Mouser Part <http://www.mouser.com/ProductDetail/Keystone-Electronics/3568> Datasheet <http://www.mouser.com/ds/2/215/568-742601.pdf> Bussman/Eaton Midget Fuse Clip 1A3400 <http://www.mouser.com/ProductDetail/Bussmann-Eaton/BK-1A3400-09-R/?qs=sGAEpiMZZMuG%252bgnN5hGYGzzlAelq2OxnKqVSMVjq8I4%3d> Schurter 0751.0110 Brass Fuse Clip Datasheet <http://www.mouser.com/ds/2/358/typ_OG__Clip__5x20-2553.pdf> Bel Fuse 0ZCF Series Surface Mount PTC (resettable) Fuse Datasheet <https://belfuse.com/resources/CircuitProtection/datasheets/0ZCF%20Nov2016.pdf> Littelfuse 1812L Series Surface Mount PTC (resettable) Fuse Datasheet <https://m.littelfuse.com/~/media/electronics/datasheets/resettable_ptcs/littelfuse_ptc_1812l_datasheet.pdf.pdf>
BOARD_TEMP = HyTechDevices:THERMISTOR_NCP21: Murata NCP Thermistor Datasheet <http://www.murata.com/~/media/webrenewal/support/library/catalog/products/thermistor/ntc/r44e.ashx>
BR1 BR2 PD1 PD2 PU1 PU2 R1-R46 R100-R139 = HyTechDevices:RESISTOR: Resistor Basic schematic elements and footprints for 0603, 1206, and PTH resistors.
C1-C50 C100-C121 = HyTechDevices:CAP: Capacitor Standard 0603 ceramic capacitor, and 0.1" leaded capacitor.
CAL_BRAKE = HyTechDevices:TRIMPOT_3296: 3296 Series 3/8" Square Trimmer Source <https://github.com/chiengineer/Eagle-Libraries/blob/master/Potentiometers/bourns.lbr>
CAN100 CAN101 = HyTechDevices:MCP2551: MCP2551 High-Speed CAN Transceiver Product Webpage <https://www.microchip.com/wwwproducts/en/MCP2551> Datasheet <http://ww1.microchip.com/downloads/en/DeviceDoc/21667f.pdf> This device is outdated It is replaced by MCP2561. Comparison Page <https://www.microchip.com/wwwproducts/ProductCompare/MCP2551/MCP2561> Product Webpage <https://www.microchip.com/wwwproducts/en/MCP2561> Datasheet <http://ww1.microchip.com/downloads/en/DeviceDoc/20005167C.pdf>
CAN_TERM_JMP1 = HyTechDevices:M02: Standard 2-pin 0.1" header. NOTES ON THE VARIANTS LOCK and LOCK_LONGPADS... This footprint was designed to help hold the alignment of a through-hole component (i.e. 6-pin header) while soldering it into place. You may notice that each hole has been shifted either up or down by 0.005 of an inch from it's more standard position (which is a perfectly straight line). This slight alteration caused the pins (the squares in the middle) to touch the edges of the holes. Because they are alternating, it causes a "brace" to hold the component in place. 0.005 has proven to be the perfect amount of "off-center" position when using our standard breakaway headers. Although looks a little odd when you look at the bare footprint, once you have a header in there, the alteration is very hard to notice. Also,if you push a header all the way into place, it is covered up entirely on the bottom side. This idea of altering the position of holes to aid alignment will be further integrated into the Sparkfun Library for other footprints. It can help hold any component with 3 or more connection pins. Note: The Sparkfun version includes many other packages including surface mount that may be of future interest. Source: Sparkfun <https://github.com/sparkfun/SparkFun-Eagle-Libraries>
D1-D8 D103 D105-D107 D109-D113 = HyTechDevices:DIODE: DIODE general purpose rectifier
D9-D12 D100-D102 D104 D108 = HyTechDevices:DIODE_ZENER: ZENER DIODE
IMD_SHUTDOWN_RLY1 U2-U4 = HyTechDevices:RT424009: TE/Schrack Double Pull Double Throw Relay 9VDC Datasheet <https://www.mouser.com/datasheet/2/418/NG_DS_RT2_1014-736201.pdf> Product Page <https://www.te.com/usa-en/product-6-1393243-2.html>
INVERTER_PWR_RELAY1 = HyTechDevices:G5LE: Omron G5LE SPST Relay 5 VDC, 12VDC, 24VDC models Coil voltage: 75% - 170% of nominal voltage Datasheet <https://www.omron.com/ecb/products/pdf/en-g5le.pdf>
J1 = HyTechDevices:JUMPER: Jumper for changing operation of a device
MTK3339_BREAKOUT = HyTechDevices:MTK3339: MTK3339 66 channel, 10 Hz GPS breakout board Adafruit Link <https://www.adafruit.com/product/746>
Q1 Q100 Q103 = HyTechDevices:P-CHANNEL_MOSFET_DMP3099L-7: Diodes Incorporated P-Channel Enhancement Mode MOSFET Datasheet <http://www.mouser.com/ds/2/115/DMP3099L-266220.pdf>
Q101 Q102 = HyTechDevices:DMG3406L: Generic NPN MOSFET DMG3406L (SOT-23, 2.8 A 30V)
REG1 = HyTechDevices:OKI-78SR-3.3: Murata OKI-78SR 5V 1.5A Non-Isolated Switching Regulator DC/DC - Datasheet <https://power.murata.com/data/power/oki-78sr.pdf>
REG2 = HyTechDevices:OKI-78SR-5: Murata OKI-78SR 5V 1.5A Non-Isolated Switching Regulator DC/DC - Datasheet <https://power.murata.com/data/power/oki-78sr.pdf>
S1 = HyTechDevices:BTN_10-XX: Small momentary tactile push button
U1 = HyTechDevices:TEENSY_3.5_EXT: Simple version of the Teensy 3.5 board that only uses the 2 main rows of pins, plus the perpendicular row with VBat.
U5 = HyTechDevices:TEENSY_3.2_SIMPLE: Simple version of the Teensy 3.2 board that only uses the 2 main rows of pins, not the inner pins or the pins opposite the usb port.
U6 U17 U19 U28 U29 U106 = HyTechDevices:OPA990IDBVR: TI OPA990 20V Op-Amp Comparator Datasheet <https://www.ti.com/lit/ds/symlink/opa990.pdf>
U7 U24 U33 U38 U39 U44 U45 = HyTechDevices:MAX7480: 8th-order lowpass butterworth filter
U8 U37 = HyTechDevices:MCP3204
U9 U34 = HyTechDevices:TXB0104: Texas Instruments TXB0104 4-channel low voltage to high voltage Logic Level Shifter. Minimum input voltage level 1.8V. Maximum output voltage level 5.5V.
U10 U23 = HyTechDevices:LM293: Texas Instruments LM293 Dual Differential Comparator
U11 U107 = HyTechDevices:SN74AHC1G09: TI SN74AHC1G09 Single 2–Input Positive-AND Gate With Open-Drain Output Datasheet <http://www.ti.com/lit/ds/symlink/sn74ahc1g09.pdf>
U18 U25 = HyTechDevices:SN74LVC1G32: TI SN74LVC1G32 Single 2-Input Positive-OR Gate Datasheet <https://www.ti.com/lit/ds/symlink/sn74lvc1g32.pdf?ts=1594782477606&ref_url=https%253A%252F%252Fwww.google.com%252F>
U35 U103 = HyTechDevices:ACHS-7121
U36 = HyTechDevices:CDSOT23-T24CAN-Q: CAN Bus dual TVS array for transceiver ESD and surge protection
U41 U42 = HyTechDevices:N-CHANNEL_MOSFET: Generic N-Channel MOSFET
U100 U101 U104 U105 = HyTechDevices:MCP6002: Microchip MCP6002 Dual Channel Op Amp
U102 = HyTechDevices:MC34152: Microchip MC34152 High Speed Dual MOSFET Driver
U108 = HyTechDevices:STWD100PYW83F: STWD100 Watchdog Timer (push-pull configuration) Datasheet <https://www.st.com/resource/en/datasheet/stwd100.pdf>
U109 = HyTechDevices:CR-2450/G1AN: Panasonic CR2450 Battery through hole.
X1 X2 X101 = HyTechDevices:CONNECTOR-4: Mini-Fit Junior connector 4 pole Source: http://www.molex.com
X100 = HyTechDevices:CONNECTOR-37: Mini-Fit Junior connector 12 pole Source: http://www.molex.com
XBEE = HyTechDevices:XBEE: Source: Adafruit <https://github.com/adafruit/Adafruit-Eagle-Library>